# EasyEDA Pro project 焊接过滤风扇.eprj

# Schematic Schematic1
Board Name: Board1; Create Date: 2024-11-07; Page Name: P1; Project Name: 焊接过滤风扇; Schematic Name: Schematic1; Update Date: 2024-11-08; Company: 嘉立创EDA; Page Size: A4; Version: V1.0
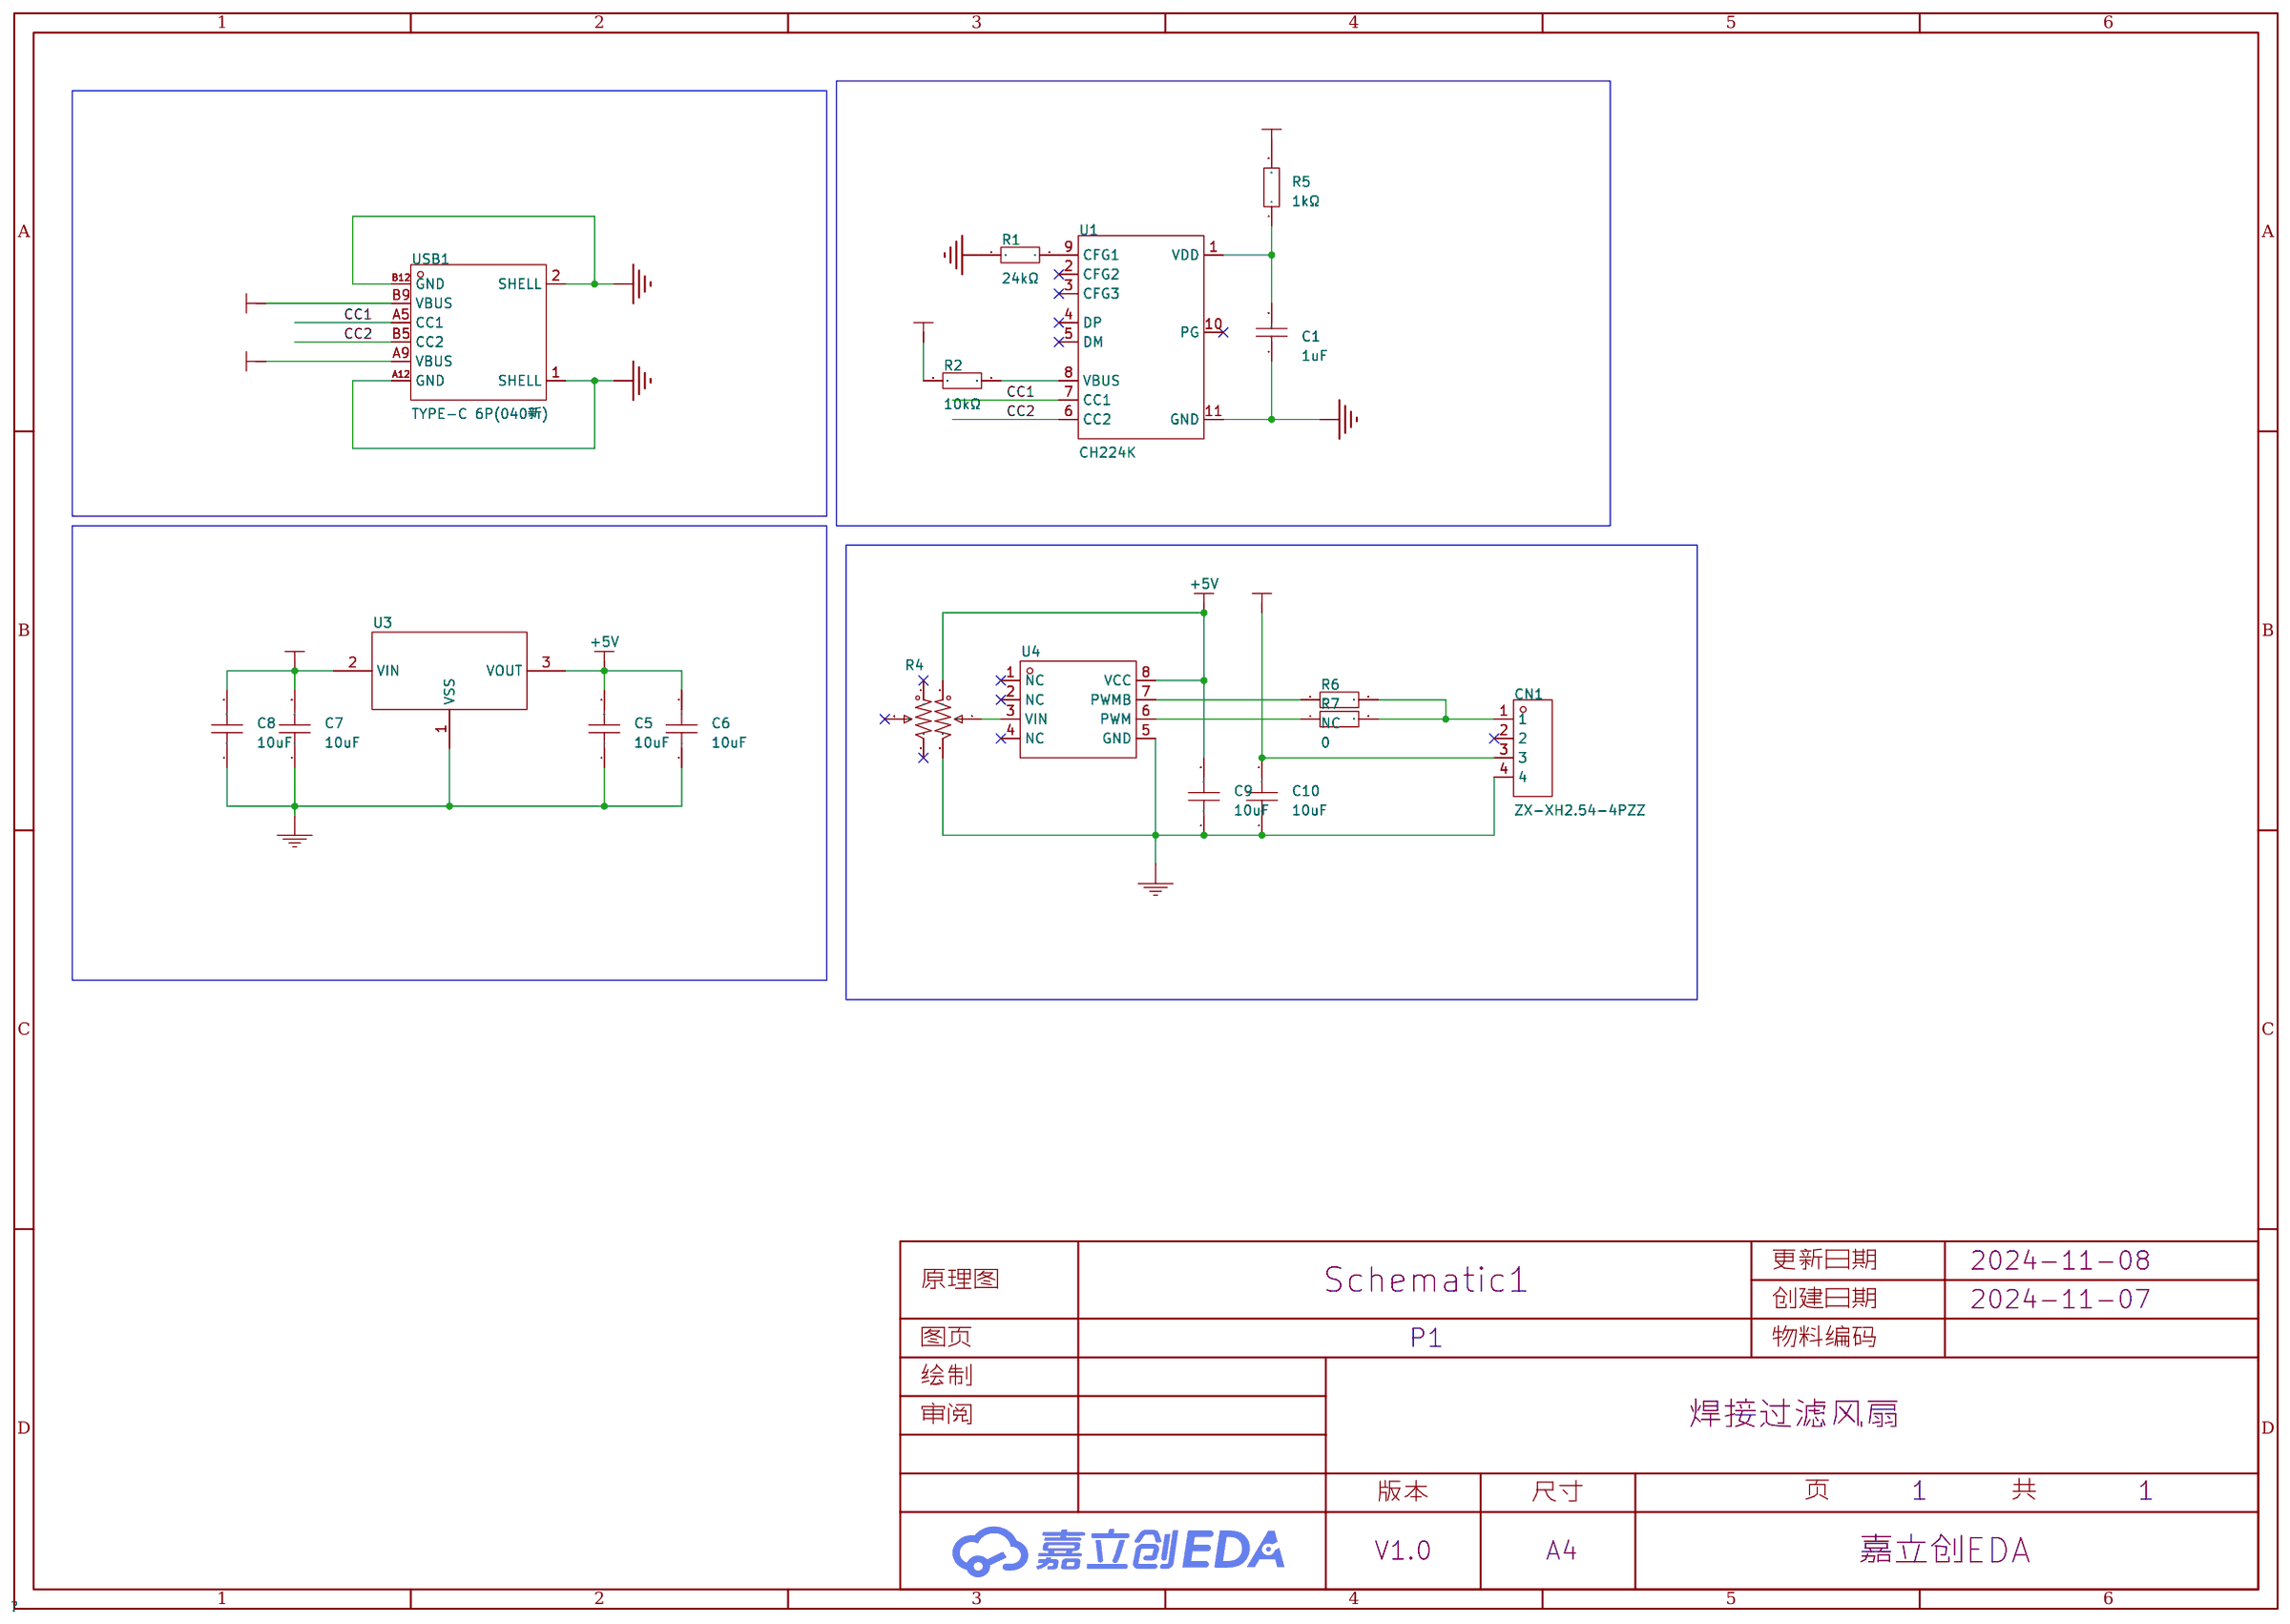
[diagram p0: schematic sheet]

## Parts
C1  1uF  [C0805]
C5  10uF  [C0805]
C6  10uF  [C0805]
C7  10uF  [C0805]
C8  10uF  [C0805]
C9  10uF  [C0805]
C10  10uF  [C0805]
CN1  ZX-XH2.54-4PZZ  [CONN-TH_4P-P2.50_4PIN]
R1  24kΩ  [R0805]
R2  10kΩ  [R0805]
R4  100kΩ  [RES-ADJ-TH_RK09712200MY]
R5  1kΩ  [R0805]
R6  NC  [R0805]
R7  0  [R0805]
U1  CH224K  [ESSOP-10_L4.9-W3.9-P1.0-LS6.0-TL-EP]
U3  ME6203A50PG  [SOT-89_L4.5-W2.5-P1.50-LS4.2-BR]
U4  GP9101-F20K-L2H1-SW  [SOP-8_L5.0-W3.9-P1.27-LS6.0-BL]
USB1  TYPE-C 6P(040新)  [USB-C-SMD_TYPE-C-6P]

## Library data of the parts
C1 = CL21B105KBFNNNE: 容值:1uF;精度:±10%;额定电压:50V;材质(温度系数):X7R;; LCSC Part Name: 1uF ±10% 50V; Supplier Part: C28323; Manufacturer: SAMSUNG(三星); Supplier Footprint: 0805; JLCPCB Part Class: 基础库; Datasheet: https://atta.szlcsc.com/upload/public/pdf/source/20160218/1457707763339.pdf; Supplier: LCSC; Tolerance: ±10%; Voltage Rated: 50V; Temperature Coefficient: X7R
C5-C10 = CGA0805X5R106K350MT: 容值:10uF;精度:±10%;额定电压:35V;材质(温度系数):X5R;; LCSC Part Name: 10uF ±10% 35V; Supplier Part: C6119888; Manufacturer: HRE(芯声); Supplier Footprint: 0805; JLCPCB Part Class: 扩展库; Supplier: LCSC; Tolerance: ±10%; Voltage Rated: 35V; Temperature Coefficient: X5R
CN1 = ZX-XH2.54-4PZZ: 插针结构:1x4P;间距:2.54mm;安装方式:直插;参考系列:XH;总PIN数:4P;排数:1;每排PIN数:4;行距:-;额定电流:3A;触头材质:黄铜;触头镀层:锡;工作温度范围:-25℃~+85℃;; Supplier Part: C7429634; Manufacturer: Megastar(兆星); Supplier Footprint: 插件,P=2.5mm; JLCPCB Part Class: 扩展库; Datasheet: https://atta.szlcsc.com/upload/public/pdf/source/20230619/B529A2163E0159A644AB3383D208FB03.pdf; Supplier: LCSC; Pins Structure: 1x4P; Pitch: 2.54mm; Mounting Style: 直插; Reference Series: XH; Number of Pins: 4P; Number of Rows: 1; Number of PINs Per Row: 4; Current Rating (Max): 3A; Contact Material: 黄铜; Contact Plating: 锡; Operating Temperature Range: -25℃~+85℃
R1 = 0805W8F2402T5E: 电阻类型:厚膜电阻;阻值:24kΩ;精度:±1%;功率:125mW;最大工作电压:150V;温度系数:±100ppm/℃;; LCSC Part Name: 24kΩ ±1% 125mW 厚膜电阻; Supplier Part: C17575; Manufacturer: UNI-ROYAL(厚声); Supplier Footprint: 0805; JLCPCB Part Class: 基础库; Datasheet: https://atta.szlcsc.com/upload/public/pdf/source/20200306/C422600_1E6D84923E4A46A82E41ADD87F860B5C.pdf; Supplier: LCSC; Type: 厚膜电阻; Tolerance: ±1%; Power(Watts): 125mW; Overload Voltage (Max): 150V; Temperature Coefficient: ±100ppm/℃; Operating Temperature Range: -55℃~+155℃
R2 R6 R7 = 0805W8J0103T5E: 电阻类型:厚膜电阻;阻值:10kΩ;精度:±5%;功率:125mW;最大工作电压:150V;温度系数:±100ppm/℃;; LCSC Part Name: 10kΩ ±5% 125mW 厚膜电阻; Supplier Part: C25612; Manufacturer: UNI-ROYAL(厚声); Supplier Footprint: 0805; JLCPCB Part Class: 扩展库; Datasheet: https://atta.szlcsc.com/upload/public/pdf/source/20200306/C422600_1E6D84923E4A46A82E41ADD87F860B5C.pdf; Supplier: LCSC; Type: 厚膜电阻; Tolerance: ±5%; Power(Watts): 125mW; Overload Voltage (Max): 150V; Temperature Coefficient: ±100ppm/℃; Operating Temperature Range: -55℃~+155℃
R4 = RK09712200MY: 阻值:10kΩ;精度:±20%;; LCSC Part Name: 10kΩ ±20% 三件套; Supplier Part: C231763; Manufacturer: ALPSALPINE(阿尔卑斯阿尔派); Supplier Footprint: 插件; JLCPCB Part Class: 扩展库; Datasheet: https://atta.szlcsc.com/upload/public/pdf/source/20191107/C444934_DB02548289CDA4D147B389ED0787F1D2.pdf; Supplier: LCSC; Tolerance: ±20%
R5 = 0805W8F1001T5E: 电阻类型:厚膜电阻;阻值:1kΩ;精度:±1%;功率:125mW;最大工作电压:150V;温度系数:±100ppm/℃;; LCSC Part Name: 1kΩ ±1% 125mW 厚膜电阻; Supplier Part: C17513; Manufacturer: UNI-ROYAL(厚声); Supplier Footprint: 0805; JLCPCB Part Class: 基础库; Datasheet: https://atta.szlcsc.com/upload/public/pdf/source/20200306/C422600_1E6D84923E4A46A82E41ADD87F860B5C.pdf; Supplier: LCSC; Type: 厚膜电阻; Tolerance: ±1%; Power(Watts): 125mW; Overload Voltage (Max): 150V; Temperature Coefficient: ±100ppm/℃; Operating Temperature Range: -55℃~+155℃
U1 = CH224K: 应用功能:USB充电芯片;; LCSC Part Name: USB PD等多快充协议受电芯片CH224; Supplier Part: C970725; Manufacturer: WCH(南京沁恒); Supplier Footprint: ESSOP-10-150mil-1mm; JLCPCB Part Class: 扩展库; Datasheet: https://atta.szlcsc.com/upload/public/pdf/source/20240313/43C2AFDDBDD1F65B60386D2CCAB0811B.pdf; Supplier: LCSC; Applications Function: USB充电芯片
U3 = ME6203A50PG: 输出类型:固定;最大输入电压:30V;输出电压:5V;最大输出电流:100mA;电源纹波抑制比(PSRR):40dB@(1kHz);输出极性:正极;; LCSC Part Name: 输入30V 输出5V 100mA; Supplier Part: C94056; Manufacturer: MICRONE(南京微盟); Supplier Footprint: SOT-89; JLCPCB Part Class: 扩展库; Datasheet: https://atta.szlcsc.com/upload/public/pdf/source/20170116/1484561288466.pdf; Supplier: LCSC; Output Type: 固定; Maximum Input Voltage: 30V; Output Voltage: 5V; MAX Output Current: 100mA; Power Supply Rejection Ratio (PSRR): 40dB@(1kHz); Output Polarity: 正极; Number of Outputs: 1; Output Current: 100mA
U4 = GP9101-F20K-L2H1-SW: GP9101 0-VCC转PWM 20KHz L2H1; LCSC Part Name: 模拟信号转PWM信号; Supplier Part: C2837710; Manufacturer: Guestgood(客益); Supplier Footprint: SOP8; JLCPCB Part Class: 扩展库; Datasheet: https://atta.szlcsc.com/upload/public/pdf/source/20210611/C2837710_B55E2012AD9BA99B0BFF632E52DE3359.pdf; Supplier: LCSC
USB1 = TYPE-C 6P(040新): 连接器类型:Type-C;标准:USB 3.1;公母:母;安装方式:卧贴;触点数量:6P;端口数量:1;额定电流 - 电源:3A;工作温度范围:-40℃~+85℃;; LCSC Part Name: Type-C 母 卧贴; Supplier Part: C2887422; Manufacturer: SHOU HAN(首韩); Supplier Footprint: SMD; JLCPCB Part Class: 扩展库; Datasheet: https://atta.szlcsc.com/upload/public/pdf/source/20210820/A6D4675B44FEA528A0512D7C06DEA92E.pdf; Supplier: LCSC; Connector Type: Type-C; Standard: USB 3.1; Gender: 母; Mounting Style: 卧贴; Number of Contacts: 6P; Number of Ports: 1; Current Rating - Power (Max): 3A; Operating Temperature Range: -40℃~+85℃; Rated Voltage (Max): 20V; Connect-Disconnect Life: 3千次; Core Colour: 黑色

## Nets
+5V: C5.2 C6.2 C9.2 R4.1 U3.3(VOUT) U4.8(VCC)
+12V: C7.2 C8.2 C10.2 CN1.3 U3.2(VIN)
GND: C1.1 C5.1 C6.1 C7.1 C8.1 C9.1 C10.1 CN1.4 R1.1 R4.3 U1.11(GND) U3.1(VSS) U4.5(GND) USB1.1(SHELL) USB1.2(SHELL) USB1.A12(GND) USB1.B12(GND)
VBUS: R2.1 R5.2 USB1.A9(VBUS) USB1.B9(VBUS)
CC1: U1.7(CC1) USB1.A5(CC1)
CC2: U1.6(CC2) USB1.B5(CC2)
$1N1092: R1.2 U1.9(CFG1)
$1N1277: C1.2 R5.1 U1.1(VDD)
$1N1388: R2.2 U1.8(VBUS)
$1N2171: R4.2 U4.3(VIN)
$1N2732: R6.1 U4.7(PWMB)
$1N2778: R7.1 U4.6(PWM)
$1N2784: CN1.1 R6.2 R7.2

Not connected (* = marked no-connect by the designer): CN1 2*; R4 4* 5* 6*; U1 2(CFG2)* 3(CFG3)* 4(DP)* 5(DM)* 10(PG)*; U4 1(NC)* 2(NC)* 4(NC)*

# Board PCB1
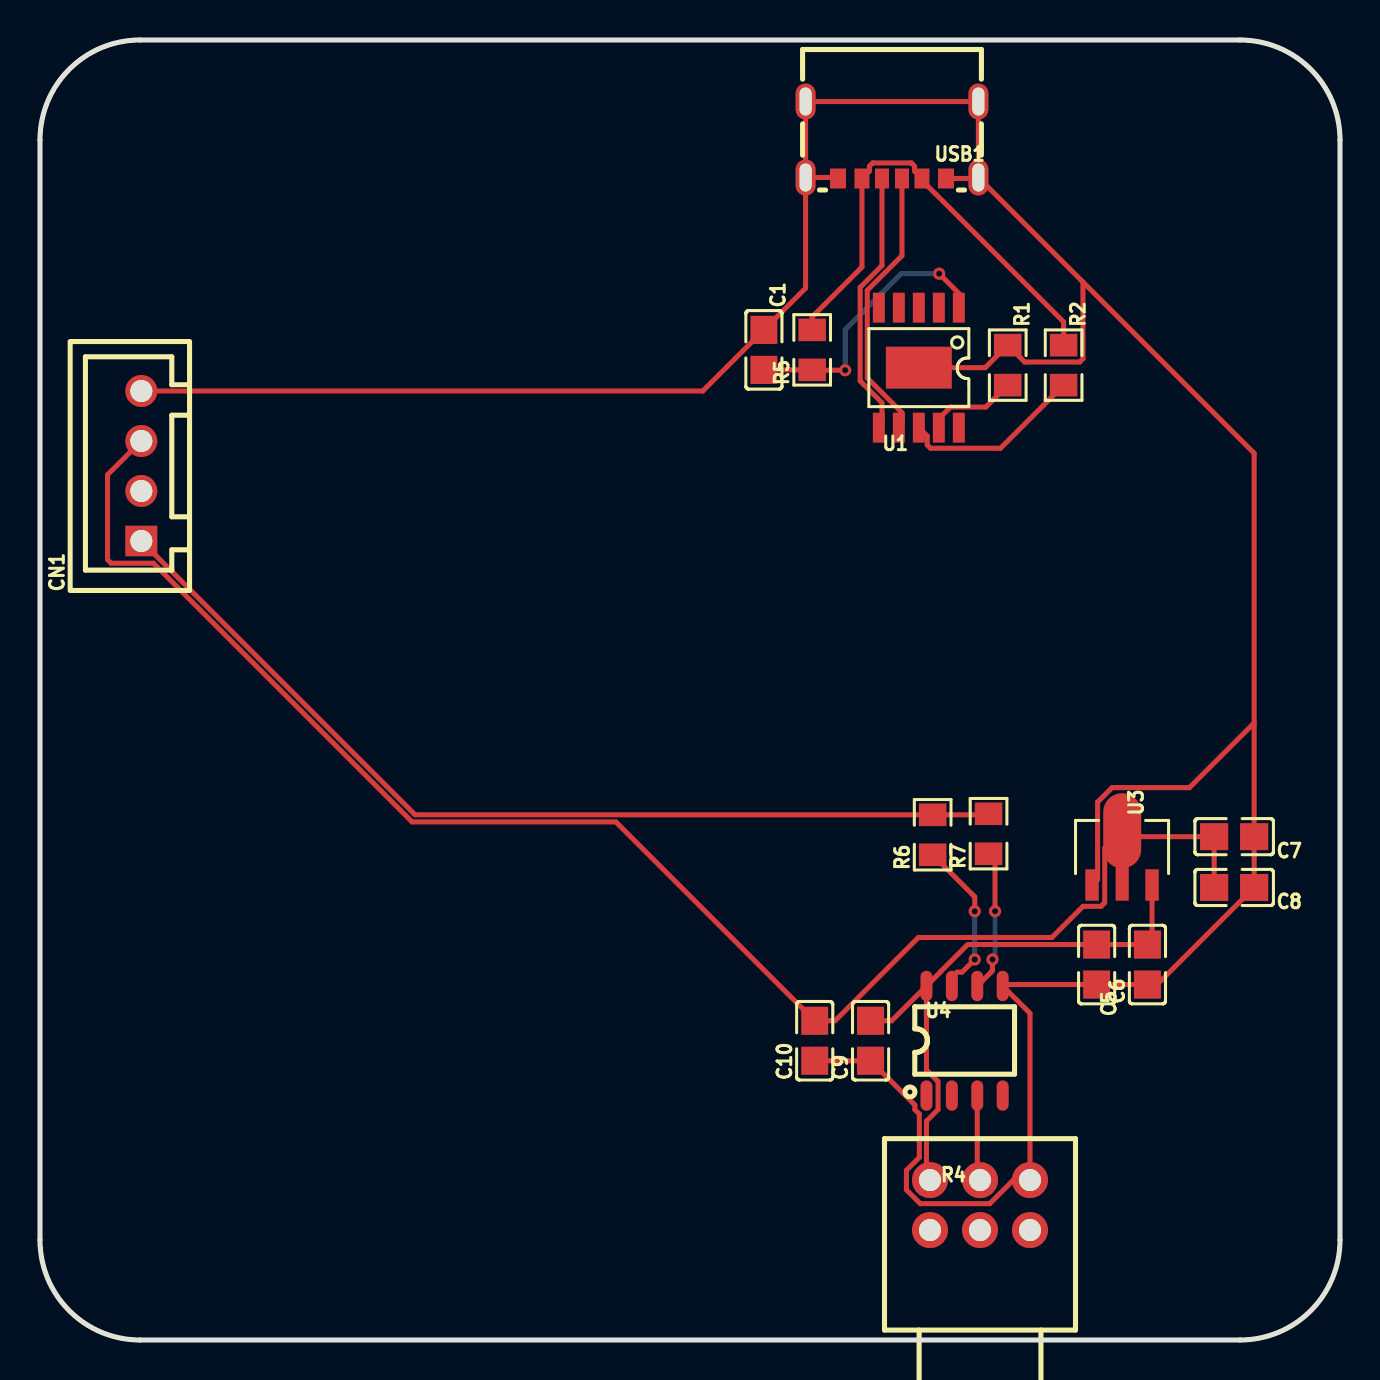
[diagram p1: board, top side]
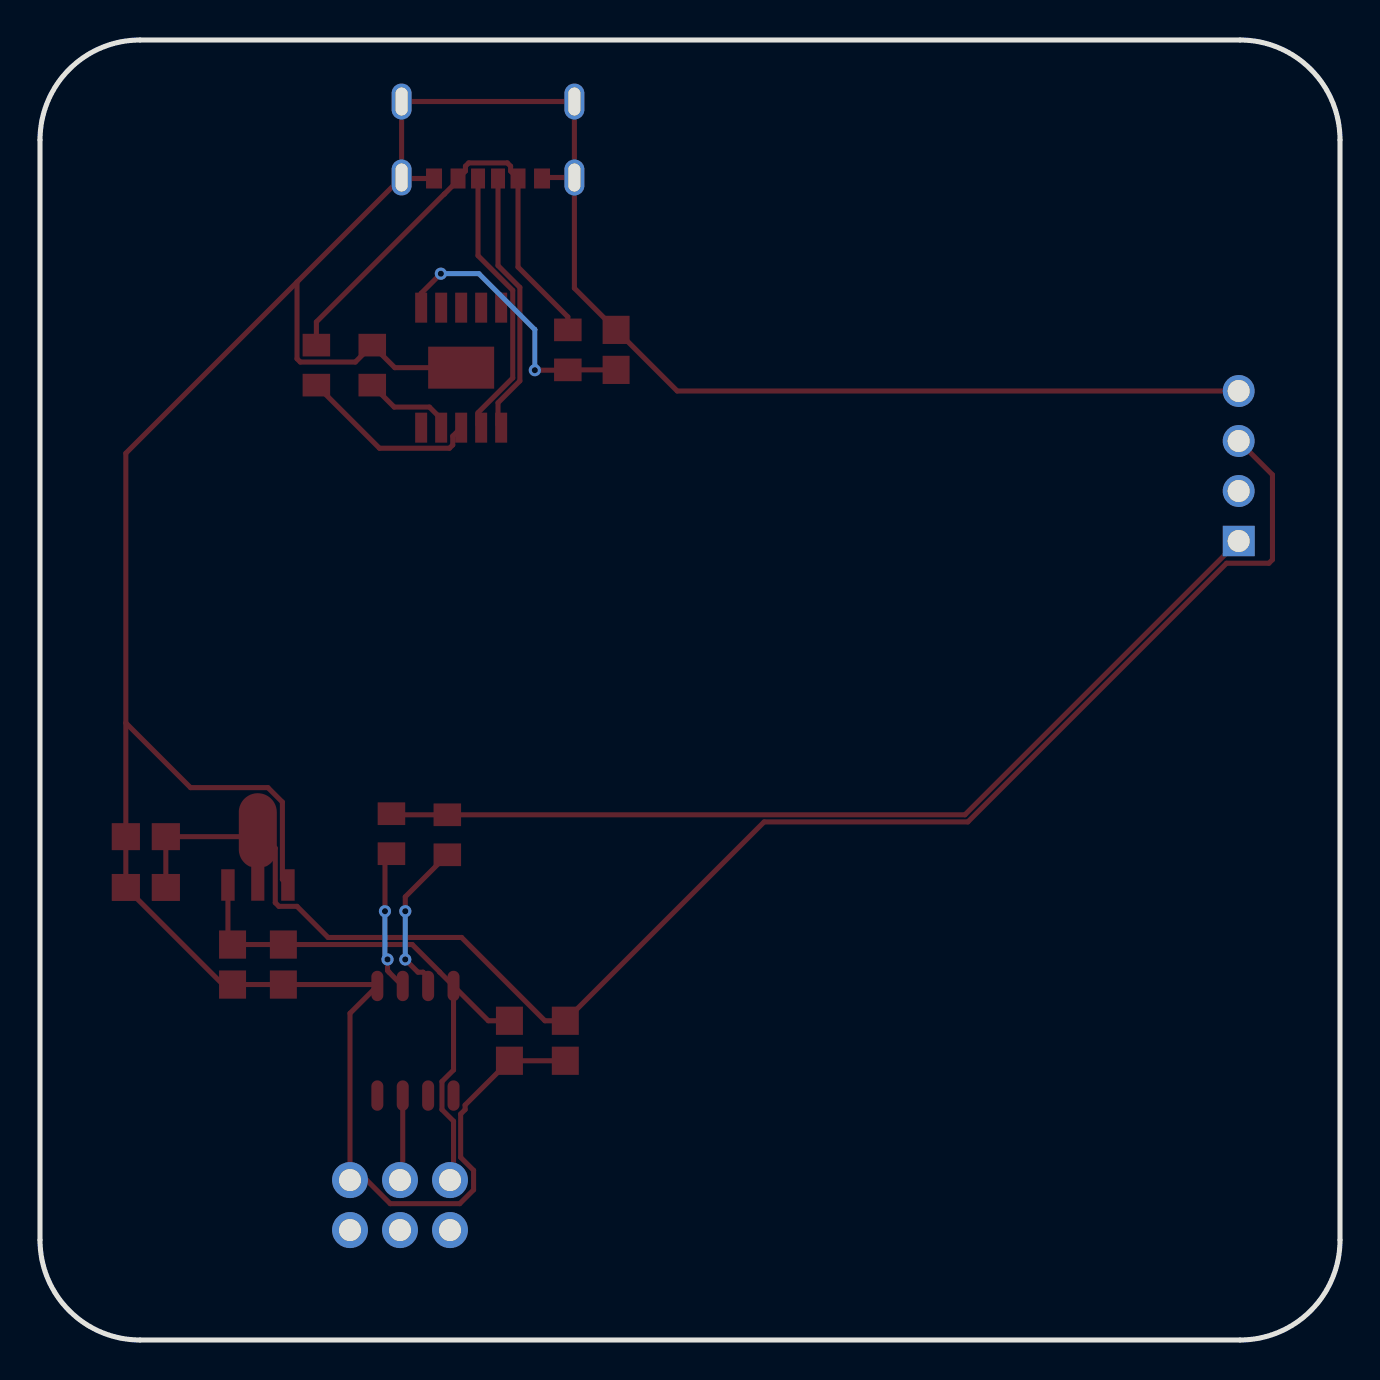
[diagram p2: board, bottom side, seen from below]

Outline 65 x 65 mm; copper layers: Top Layer, Bottom Layer. Coordinates in mm from the lower left corner of the outline.
Outline path: 0,60 0,5 arc(1.46,1.46) 5,0 60,0 arc(63.54,1.46) 65,5 65,60 arc(63.54,63.54) 60,65 5,65 arc(1.46,63.54) 0,60
Stack: Top Layer 0.035mm / Dielectric1 1.51mm FR4 er 4.5 / Bottom Layer 0.035mm

## Design rules (mm)
template: JLCPCB Capability(Two Layers Board)
spacing copperThickness1oz (default): track to track 0.102, other pairs 0.152 to 0.3
spacing copperThickness2oz: track to track 0.203, other pairs 0.152 to 0.3
track width copperThickness1oz (default): min 0.127, default 0.254, max 2.54
track width copperThickness2oz: min 0.203, default 0.254, max 2.54
differential pair differentialPair (default): width min 0.127, default 0.254, max 2.54; gap min 0.152, default 0.152
via viaSize (default): diameter min 0.5, default 0.61, max 10; hole min 0.3, default 0.305, max 6.3

## Placement (name value [footprint] x y rotation side)
C1  1uF  [C0805]  36.19 49.51 270 top
C5  10uF  [C0805]  52.83 18.77 90 top
C6  10uF  [C0805]  55.37 18.77 90 top
C7  10uF  [C0805]  59.71 25.17 180 top
C8  10uF  [C0805]  59.71 22.63 180 top
C9  10uF  [C0805]  41.53 14.96 90 top
C10  10uF  [C0805]  38.74 14.96 90 top
CN1  ZX-XH2.54-4PZZ  [CONN-TH_4P-P2.50_4PIN]  5.06 43.7 90 top
R1  24kΩ  [R0805]  48.39 48.74 270 top
R2  10kΩ  [R0805]  51.18 48.74 270 top
R4  100kΩ  [RES-ADJ-TH_RK09712200MY]  47 6.75 0 top
R5  1kΩ  [R0805]  38.61 49.51 90 top
R6  NC  [R0805]  44.63 25.26 90 top
R7  0  [R0805]  47.43 25.31 90 top
U1  CH224K  [ESSOP-10_L4.9-W3.9-P1.0-LS6.0-TL-EP]  43.94 48.62 180 top
U3  ME6203A50PG  [SOT-89_L4.5-W2.5-P1.50-LS4.2-BR]  54.1 24.11 270 top
U4  GP9101-F20K-L2H1-SW  [SOP-8_L5.0-W3.9-P1.27-LS6.0-BL]  46.23 14.96 0 top
USB1  TYPE-C 6P(040新)  [USB-C-SMD_TYPE-C-6P]  42.6 60 180 top

## Footprints (pads in the part's own frame, mm; a bottom-side part is the same pattern mirrored in y, then rotated)
C0805
  rect 1.41x1.35 smd: 1(-1,0) 2(1,0)
CONN-TH_4P-P2.50_4PIN
  rect 1.524x1.6 hole 1.1: 1(-3.75,0)
  round 1.6 hole 1.1: 2(-1.25,0) 3(1.25,0) 4(3.75,0)
ESSOP-10_L4.9-W3.9-P1.0-LS6.0-TL-EP
  rect 0.6x1.5 smd: 1(-2,-3) 2(-1,-3) 3(0,-3) 4(1,-3) 5(2,-3) 6(2,3) 7(1,3) 8(0,3) 9(-1,3) 10(-2,3)
  rect 3.3x2.1 smd: 11(0,0)
R0805
  rect 1.133x1.377 smd: 1(-1,0) 2(1,0)
RES-ADJ-TH_RK09712200MY
  round 1.8 hole 1.1: 1(-2.5,1.25) 2(0,1.25) 3(2.5,1.25) 4(-2.5,-1.25) 5(0,-1.25) 6(2.5,-1.25)
SOP-8_L5.0-W3.9-P1.27-LS6.0-BL
  oval 0.6x1.52 smd: 1(-1.905,-2.74) 2(-0.635,-2.74) 3(0.635,-2.74) 4(1.905,-2.74) 5(1.905,2.74) 6(0.635,2.74) 7(-0.635,2.74) 8(-1.905,2.74)
SOT-89_L4.5-W2.5-P1.50-LS4.2-BR
  rect 1.575x0.673 smd: 1(1.357,-1.498) 3(1.357,1.501)
  custom 5.378x1.9 smd: 2(-1.357,0.007)
USB-C-SMD_TYPE-C-6P
  oval 1x1.8 hole 0.6x1.4: 1(-4.32,1.875) 1(-4.32,-1.925) 2(4.32,1.875) 2(4.32,-1.925)
  rect 0.7x1 smd: A5(-0.499,1.925) B5(0.501,1.925)
  rect 0.75x1 smd: A9(1.501,1.925) B9(-1.499,1.925)
  rect 0.8x1 smd: A12(2.701,1.925) B12(-2.699,1.925)

## Nets
As in the schematic.

Pads without a net: CN1 2; R4 4 5 6; U1 2 3 4 5 10; U4 1 2 4

## Via types
v1: diameter 0.61, hole 0.305, Top Layer to Bottom Layer, 6 vias

## Routing (per net, layer and track width the routed paths; a pad name or vN(x,y) marks a point on that pad's centre or on a via; arc(x,y) is an arc through that point)
+5V: length 28.8
  Top Layer w0.254: U3.3 55.6,20 C6.2 C5.2 46.38,19.77 45.01,18.4 45.01,18.39 U4.8 ; R4.1 44.32,8.17 44.32,10.94 44.9,11.52 44.9,12.92 44.32,13.5 U4.8 ; U4.8 42.58,15.96 C9.2
+12V: length 79.7
  Top Layer w0.254: C8.2 C7.2 54.41,25.17 U3.2 53.24,24.59 53.24,21.86 53.06,21.68 52.15,21.68 50.6,20.13 43.92,20.13 39.75,15.96 C10.2 28.79,25.91 18.61,25.91 5.67,38.84 3.56,38.84 3.38,39.02 3.38,43.26 CN1.3
GND: length 170.6
  Top Layer w0.254: 60.71,30.85 57.47,27.62 53.6,27.62 52.88,26.9 52.88,23.03 U3.1 ; 60.71,30.85 C7.1 C8.1 55.85,17.77 C6.1 C5.1 48.2,17.77 U4.5 49.5,16.33 R4.3 48.67,8 47.49,6.82 44.01,6.82 43.32,7.51 43.32,8.48 43.97,9.13 43.97,11.3 43.74,11.52 43.74,11.75 C9.1 C10.1 ; 60.71,30.85 60.71,44.34 52.15,52.9 ; USB1.1 46.87,58.08 USB1.B12 ; USB1.1 USB1.1 USB1.2 USB1.2 ; USB1.1 52.15,52.9 ; USB1.2 38.28,52.59 C1.1 33.14,47.45 CN1.4 ; USB1.2 39.85,58.12 USB1.A12 ; 52.15,52.9 52.15,49.06 51.99,48.9 49.23,48.9 R1.1 47.26,48.62 U1.11
VBUS: length 23.8
  Top Layer w0.254: R2.1 51.18,50.9 44.79,57.3 44.78,57.3 44.1,57.98 USB1.B9 43.73,58.45 43.73,58.69 43.56,58.85 41.63,58.85 41.47,58.69 41.47,58.45 USB1.A9 41.1,53.65 38.61,51.16 R5.2
CC1: length 14
  Top Layer w0.254: U1.7 43.1,45.77 43.1,46.37 41.36,48.1 41.36,52.48 43.1,54.22 USB1.A5
CC2: length 13.4
  Top Layer w0.254: USB1.B5 42.1,53.72 41.01,52.63 41.01,47.95 42.1,46.86 42.1,45.77 U1.6
$1N1092: length 4.6
  Top Layer w0.254: U1.9 44.94,46.06 45.53,46.65 47.29,46.65 R1.2
$1N1277: length 14.1
  Top Layer w0.254: v1(44.96,53.32) 45.94,52.33 U1.1 ; C1.2 R5.1 38.62,48.49 v1(40.26,48.49)
  Bottom Layer w0.254: v1(40.26,48.49) 40.26,50.52 43.05,53.32 v1(44.96,53.32)
$1N1388: length 9.2
  Top Layer w0.254: R2.2 48.03,44.59 44.53,44.59 44.36,44.75 44.36,45.2 U1.8
$1N2171: length 4.3
  Top Layer w0.254: U4.3 46.86,8.13 R4.2
$1N2732: length 8.1
  Top Layer w0.254: v1(46.74,21.44) 46.74,22.16 R6.1 ; 45.59,17.7 45.59,18.14 45.85,18.39 46.1,18.39 v1(46.74,19.03)
  Bottom Layer w0.254: v1(46.74,21.44) v1(46.74,19.03)
$1N2778: length 7.1
  Top Layer w0.254: R7.1 47.75,23.99 v1(47.75,21.44) ; v1(47.62,19.03) 47.62,18.47 47.55,18.4 47.55,18.39 U4.6
  Bottom Layer w0.254: v1(47.62,19.03) 47.75,19.15 v1(47.75,21.44)
$1N2784: length 48.1
  Top Layer w0.254: R7.2 47.37,26.26 R6.2 18.75,26.26 CN1.1
